# Altium schematic sheet F3DroneV4.SchDoc
size A2
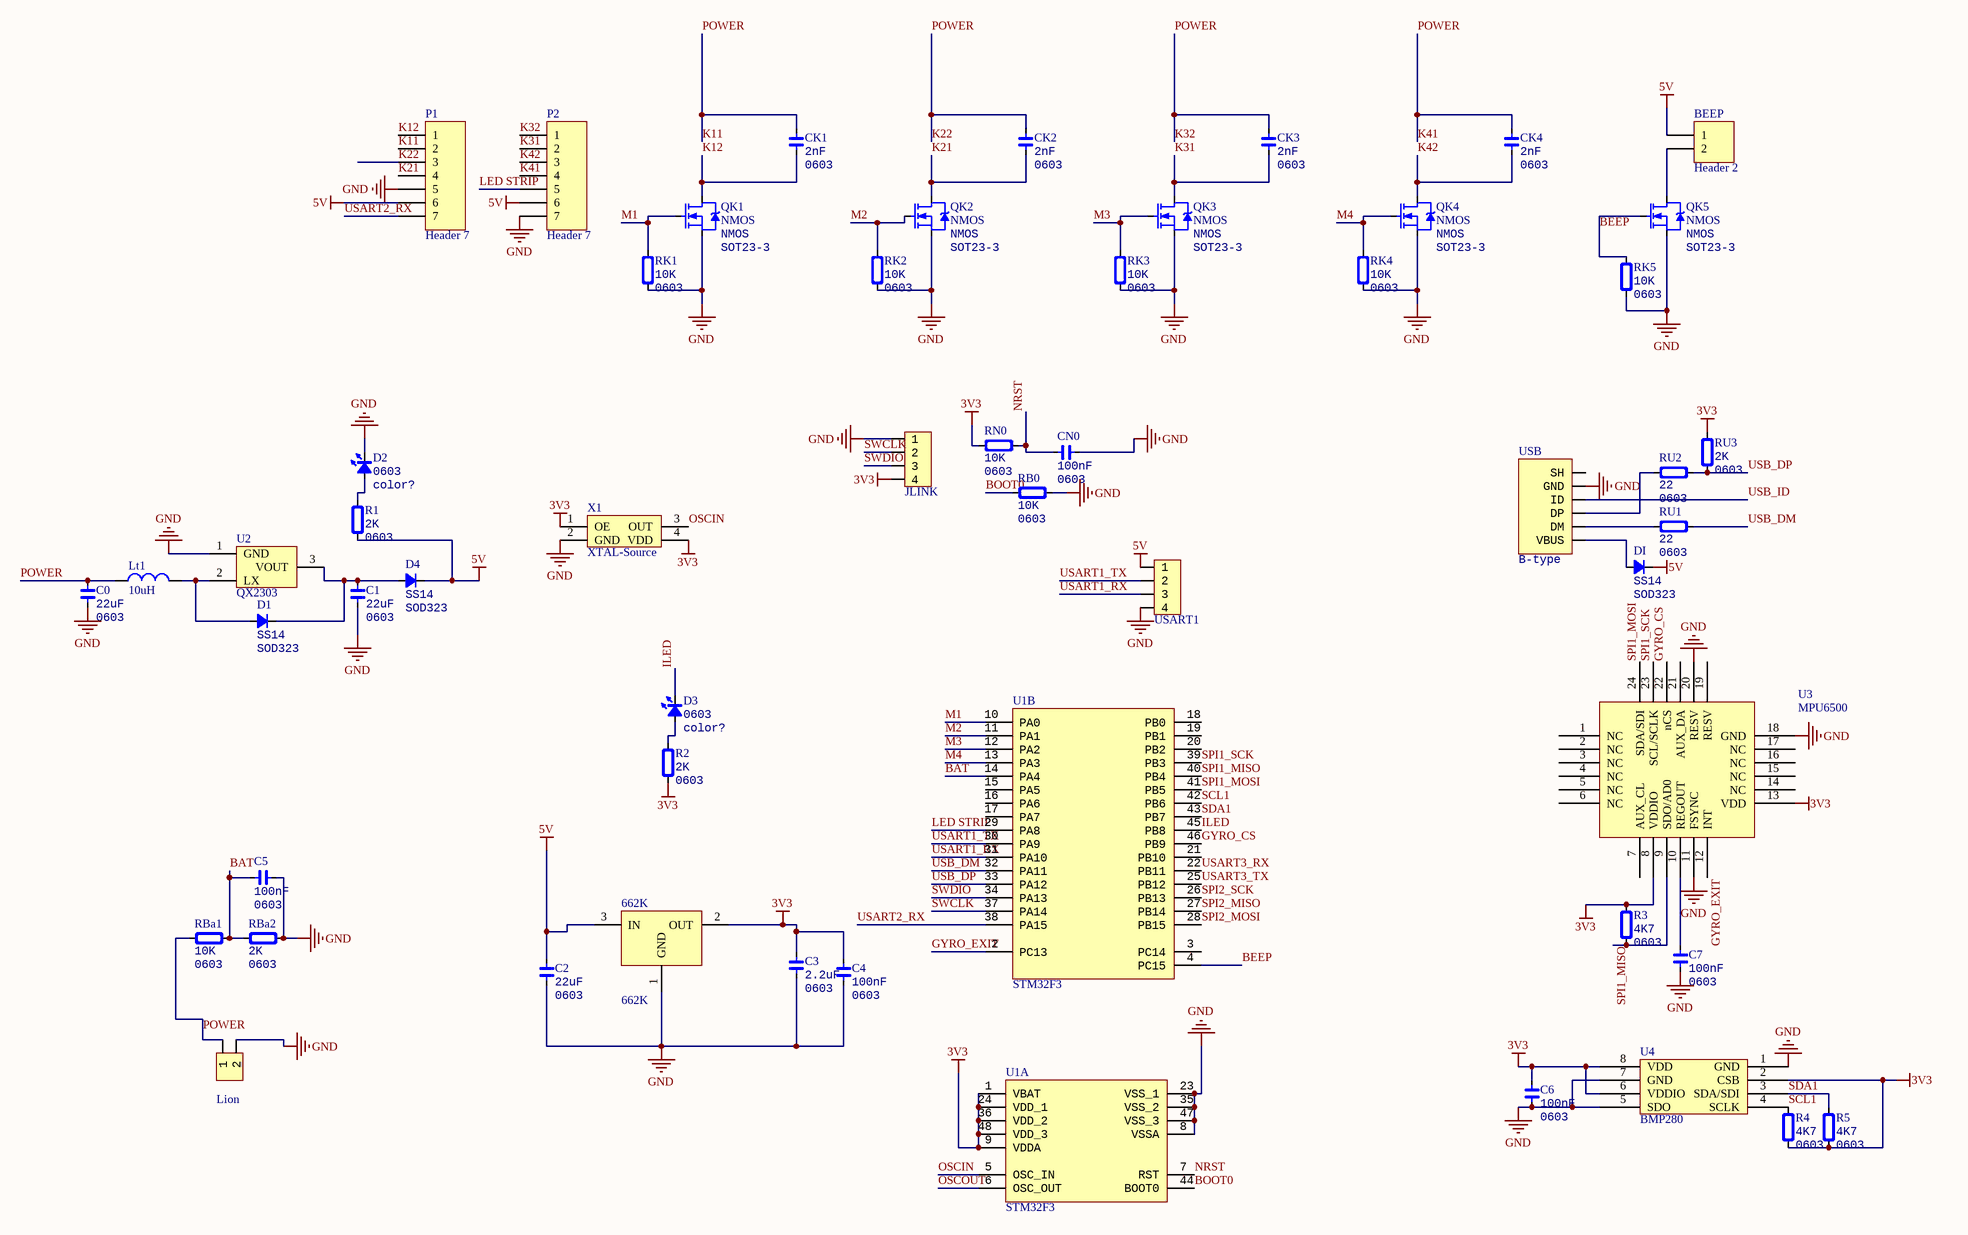
[diagram p0: F3DroneV4.SchDoc]

## Parts
662K  662K  [SOT-23]
BEEP  Header 2  [HDR1X2]
C0  value 22uF  Type: 0603  [CAP_0603]  (hidden comment: C0603)
C1  value 22uF  Type: 0603  [CAP_0603]  (hidden comment: C0603)
C2  value 22uF  Type: 0603  [CAP_0603]  (hidden comment: C0603)
C3  value 2.2uF  Type: 0603  [CAP_0603]  (hidden comment: C0603)
C4  value 100nF  Type: 0603  [CAP_0603]  (hidden comment: C0603)
C5  value 100nF  Type: 0603  [CAP_0603]  (hidden comment: C0603)
C6  value 100nF  Type: 0603  [CAP_0603]  (hidden comment: C0603)
C7  value 100nF  Type: 0603  [CAP_0603]  (hidden comment: C0603)
CK1  value 2nF  Type: 0603  [CAP_0603]  (hidden comment: C0603)
CK2  value 2nF  Type: 0603  [CAP_0603]  (hidden comment: C0603)
CK3  value 2nF  Type: 0603  [CAP_0603]  (hidden comment: C0603)
CK4  value 2nF  Type: 0603  [CAP_0603]  (hidden comment: C0603)
CN0  value 100nF  Type: 0603  [CAP_0603]  (hidden comment: C0603)
D1  Type: SOD323  [SOD-323]  (hidden comment: SS14)
D2  Type: 0603  [LED_0603_BLUE]  (hidden comment: color?)
D3  Type: 0603  [LED_0603_BLUE]  (hidden comment: color?)
D4  Type: SOD323  [SOD-323]  (hidden comment: SS14)
DI  Type: SOD323  [SOD-323]  (hidden comment: SS14)
JLINK  HDR1x4_1.27  [HDR1X4_1.27_180]  (value not drawn)
Lion  HDR1x2_1.27T  [HDR1X2_1.27_180]  (value not drawn)
Lt1  value 10uH  [0420]  (hidden comment: Inductor)
P1  Header 7  [HDR1X7]
P2  Header 7  [HDR1X7]
QK1  NMOS  [SOT23-3]
QK2  NMOS  [SOT23-3]
QK3  NMOS  [SOT23-3]
QK4  NMOS  [SOT23-3]
QK5  NMOS  [SOT23-3]
R1  value 2K  Type: 0603  [RES_0603]  (hidden comment: R0603)
R2  value 2K  Type: 0603  [RES_0603]  (hidden comment: R0603)
R3  value 4K7  Type: 0603  [RES_0603]  (hidden comment: R0603)
R4  value 4K7  Type: 0603  [RES_0603]  (hidden comment: R0603)
R5  value 4K7  Type: 0603  [RES_0603]  (hidden comment: R0603)
RB0  value 10K  Type: 0603  [RES_0603]  (hidden comment: R0603)
RBa1  value 10K  Type: 0603  [RES_0603]  (hidden comment: R0603)
RBa2  value 2K  Type: 0603  [RES_0603]  (hidden comment: R0603)
RK1  value 10K  Type: 0603  [RES_0603]  (hidden comment: R0603)
RK2  value 10K  Type: 0603  [RES_0603]  (hidden comment: R0603)
RK3  value 10K  Type: 0603  [RES_0603]  (hidden comment: R0603)
RK4  value 10K  Type: 0603  [RES_0603]  (hidden comment: R0603)
RK5  value 10K  Type: 0603  [RES_0603]  (hidden comment: R0603)
RN0  value 10K  Type: 0603  [RES_0603]  (hidden comment: R0603)
RU1  value 22  Type: 0603  [RES_0603]  (hidden comment: R0603)
RU2  value 22  Type: 0603  [RES_0603]  (hidden comment: R0603)
RU3  value 2K  Type: 0603  [RES_0603]  (hidden comment: R0603)
U1  STM32F3  [LQFP_P0.5_48]  (parts A,B of 2)
U2  QX2303  [SOT-23]
U3  MPU6500  [QFN40P300X300X90_HS-25N]
U4  BMP280  [BMP280]
USART1  HDR1x4_1.27  [HDR1X4_1.27_180]  (value not drawn)
USB  Type: B-type  [USB_Micro-AB]  (hidden comment: MicroUSB)
X1  XTAL-Source  [XTAL_3225]

## Nets
3V3: 662K.2(OUT) C3.2 C4.2 C6.1 JLINK.4 R2.1 R3.2 R4.1 R5.1 RN0.2 RU3.1 U1.1(VBAT) U1.9(VDDA) U1.24(VDD_1) U1.36(VDD_2) U1.48(VDD_3) U3.8(VDDIO) U3.13(VDD) U4.2(CSB) U4.6(VDDIO) U4.8(VDD) X1.1(OE) X1.4(VDD)
5V: 662K.3(IN) BEEP.1 C2.2 D4.2(K) DI.2(K) P1.6 P2.6 R1.1 USART1.1
GND: 662K.1(GND) C0.1 C1.1 C2.1 C3.1 C4.1 C5.1 C6.2 C7.2 CN0.1 D2.2(K) JLINK.1 Lion.2 P1.5 P2.7 QK1.2(S) QK2.2(S) QK3.2(S) QK4.2(S) QK5.2(S) RB0.1 RBa2.1 RK1.1 RK2.1 RK3.1 RK4.1 RK5.1 U1.8(VSSA) U1.23(VSS_1) U1.35(VSS_2) U1.47(VSS_3) U2.1(GND) U3.11(FSYNC) U3.18(GND) U3.20(RESV) U4.1(GND) U4.5(SDO) U4.7(GND) USART1.4 USB.5(GND) X1.2(GND)
BAT: C5.2 RBa1.1 RBa2.2 U1.14(PA4)
BEEP: QK5.1(G) RK5.2 U1.4(PC15)
BOOT0: RB0.2 U1.44(BOOT0)
GYRO_CS: U1.46(PB9) U3.22(nCS)
GYRO_EXIT: U1.2(PC13) U3.12(INT)
ILED: D3.2(K) U1.45(PB8)
K11: C0.2 CK1.2 CK2.2 CK3.2 CK4.2 Lion.1 Lt1.1 P1.2 P1.3 P2.1 P2.4 RBa1.2  [also labelled K22, K32, K41, POWER]
K12: CK1.1 P1.1 QK1.3(D)
K21: CK2.1 P1.4 QK2.3(D)
K31: CK3.1 P2.2 QK3.3(D)
K42: CK4.1 P2.3 QK4.3(D)
LED STRIP: P2.5 U1.29(PA8)
M1: QK1.1(G) RK1.2 U1.10(PA0)
M2: QK2.1(G) RK2.2 U1.11(PA1)
M3: QK3.1(G) RK3.2 U1.12(PA2)
M4: QK4.1(G) RK4.2 U1.13(PA3)
NRST: CN0.2 RN0.1 U1.7(RST)
OSCIN: U1.5(OSC_IN) X1.3(OUT)
OSCOUT: U1.6(OSC_OUT)
SCL1: R4.2 U1.42(PB6) U4.4(SCLK)
SDA1: R5.2 U1.43(PB7) U4.3(SDA/SDI)
SPI1_MISO: R3.1 U1.40(PB4) U3.9(SDO/AD0)
SPI1_MOSI: U1.41(PB5) U3.24(SDA/SDI)
SPI1_SCK: U1.39(PB3) U3.23(SCL/SCLK)
SPI2_MISO: U1.27(PB14)
SPI2_MOSI: U1.28(PB15)
SPI2_SCK: U1.26(PB13)
SWCLK: JLINK.2 U1.37(PA14)
SWDIO: JLINK.3 U1.34(PA13)
USART1_RX: U1.31(PA10) USART1.3
USART1_TX: U1.30(PA9) USART1.2
USART2_RX: P1.7 U1.38(PA15)
USART3_RX: U1.22(PB11)
USART3_TX: U1.25(PB12)
USB_DM: RU1.1 U1.32(PA11)
USB_DP: RU2.1 RU3.2 U1.33(PA12)
USB_ID: USB.4(ID)
NetBEEP_2: BEEP.2 QK5.3(D)
NetC1_2: C1.2 D1.2(K) D4.1(A) U2.3(VOUT)
NetC7_1: C7.1 U3.10(REGOUT)
NetD1_1: D1.1(A) Lt1.2 U2.2(LX)
NetD2_1: D2.1(A) R1.2
NetD3_1: D3.1(A) R2.2
NetDI_1: DI.1(A) USB.1(VBUS)
NetRU1_2: RU1.2 USB.2(DM)
NetRU2_2: RU2.2 USB.3(DP)

Not connected (* = marked no-connect by the designer): U1 3(PC14) 15(PA5) 16(PA6) 17(PA7) 18(PB0) 19(PB1) 20(PB2) 21(PB10); U3 1(NC) 2(NC) 3(NC) 4(NC) 5(NC) 6(NC) 7(AUX_CL) 14(NC) 15(NC) 16(NC) 17(NC) 19(RESV) 21(AUX_DA); USB 0(SH)

## Library data of the parts
BEEP = Header 2: Header, 2-Pin; LatestRevisionDate: 17-Jul-2002; LatestRevisionNote: Re-released for DXP Platform.; Publisher: Altium Limited
C0-C7 CK1-CK4 CN0 = Cap_0603: Capacitor; Specification: X7R 50V; Manufacturer: *
D1 D4 DI = Diode_SOD323: Diode; Value: SS14
D2 D3 = LED_0603: LED; Value: color?
JLINK USART1 = HDR1x4_1.27: Header
Lion = HDR1x2_1.27T: Header
Lt1 = Inductor: 电感; Code_IEC: 1005; Published: 8-Jun-2000; LatestRevisionDate: 17-Jul-2002; LatestRevisionNote: Re-released for DXP Platform.; PackageReference: 0402-A; Publisher: Altium Limited; Code_JEITA: 0402
P1 P2 = Header 7: Header, 7-Pin; LatestRevisionDate: 17-Jul-2002; LatestRevisionNote: Re-released for DXP Platform.; Publisher: Altium Limited
QK1-QK5 = MOSFET_N_SOT23: MOSFET; Value: NMOS; Type: SOT23-3
R1-R5 RB0 RBa1 RBa2 RK1-RK5 RN0 RU1-RU3 = Res_0603: Resistor; Specification: ±5%; Manufacturer: *
U1 = STM32F303C: MCU
USB = USB_Micro: USB